# Altium schematic sheet Hoja_Control.SchDoc: Hoja_Control
size A4; SheetNumber: 4; SheetTotal: 6; Time: Hoja de Control
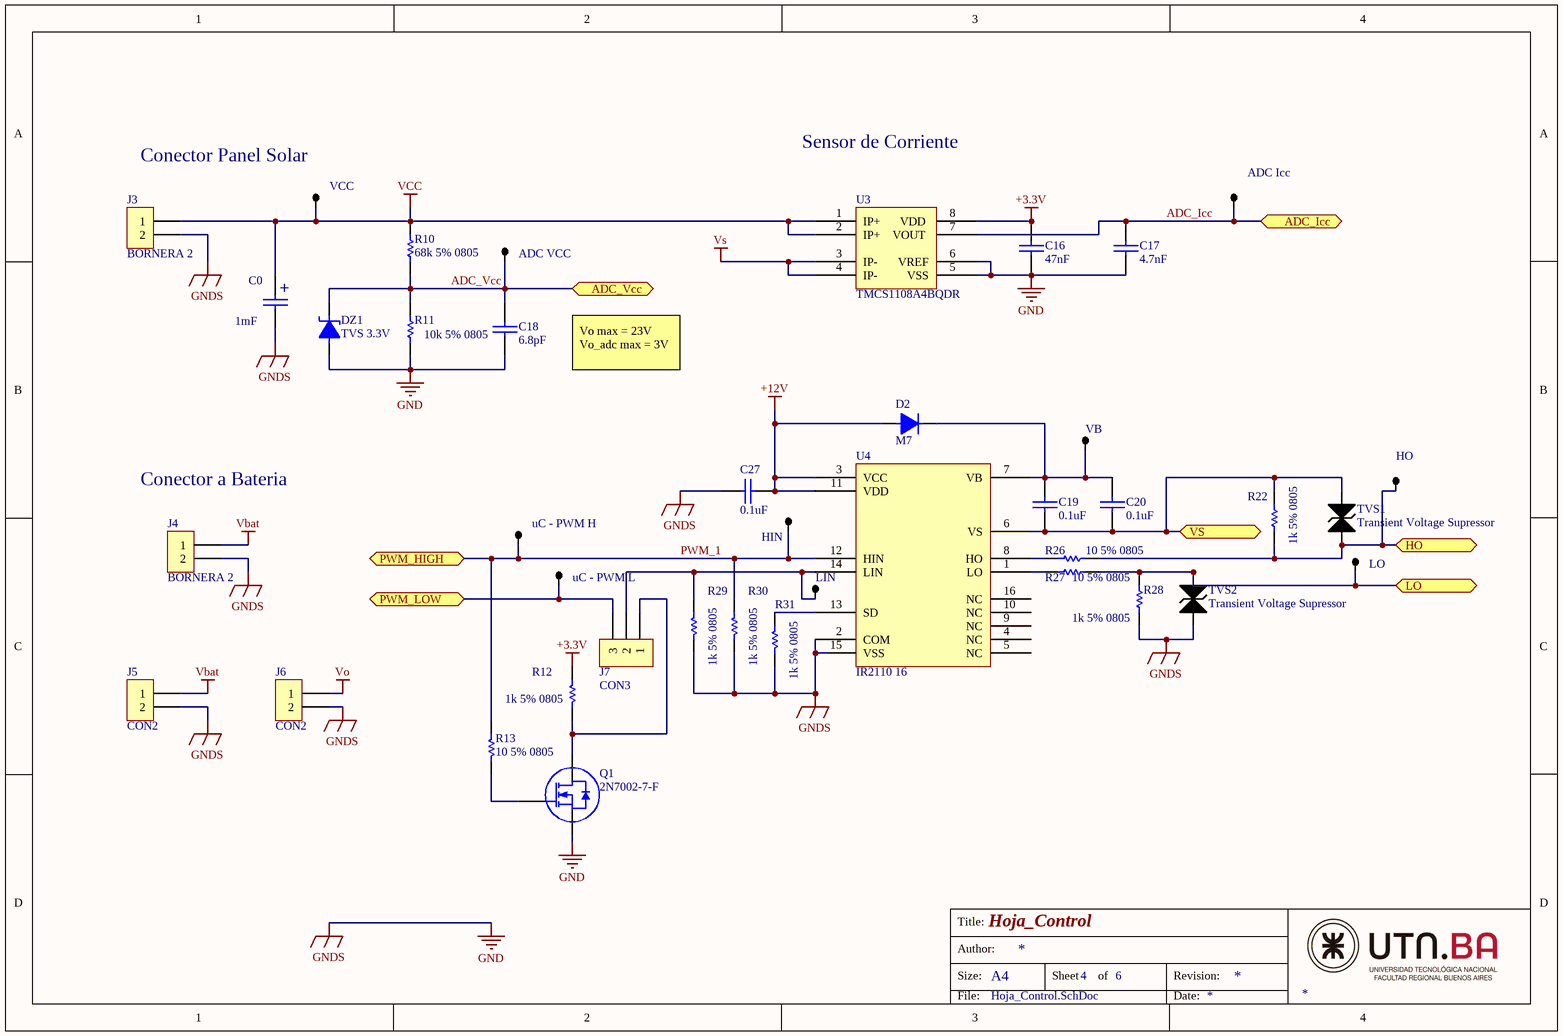
[diagram p0: Hoja_Control.SchDoc]

## Parts
ADC_Icc  ADC Icc  [TPTH]  (value not drawn)
ADC_VCC  ADC VCC  [TPTH]  (value not drawn)
C0  1mF  [CAPSMD8x8.3]
C16  47nF  [0805]
C17  4.7nF  [0805]
C18  6.8pF  [0805]
C19  0.1uF  [0805]
C20  0.1uF  [0805]
C27  0.1uF  [0805]
D2  M7  [DO-214AC]
DZ1  TVS 3.3V  [sod123]
HIN  HIN  [TPTH]
HO  HO  [TPTH]  (value not drawn)
J3  BORNERA 2  [Bornera2_DegsonH]
J4  BORNERA 2  [Bornera2_DegsonH]
J5  CON2  [SIP2]
J6  CON2  [SIP2]
J7  CON3  [SIP3]
LIN  LIN  [TPTH]  (value not drawn)
LO  LO  [TPTH]  (value not drawn)
Q1  2N7002-7-F  [SOT23]
R10  68k 5% 0805  [0805]
R11  10k 5% 0805  [0805]
R12  1k 5% 0805  [0805]
R13  10 5% 0805  [0805]
R22  1k 5% 0805  [0805]
R26  10 5% 0805  [0805]
R27  10 5% 0805  [0805]
R28  1k 5% 0805  [0805]
R29  1k 5% 0805  [0805]
R30  1k 5% 0805  [0805]
R31  1k 5% 0805  [0805]
TVS1  Transient Voltage Supressor  [SOD323]
TVS2  Transient Voltage Supressor  [SOD323]
U3  TMCS1108A4BQDR  [SOIC8]
U4  IR2110 16  [SOIC16W]
uC_-_PWM_H  PWM L  [TPTH]  (value not drawn)
uC_-_PWM_L  PWM H  [TPTH]  (value not drawn)
VB  VB  [TPTH]  (value not drawn)
VCC  VCC  [TPTH]  (value not drawn)

## Ports
ADC_Icc (bidir), ADC_Vcc (bidir), HO (bidir), LO (bidir), PWM_HIGH (bidir), PWM_LOW (bidir), VS (bidir)

## Nets
+3.3V: C16.1 R12.2 U3.8(VDD)
+12V: C27.1 D2.1 U4.3(VCC) U4.11(VDD)
GND: C0.2 C16.2 C17.2 C18.2 C27.2 DZ1.1 J3.2 J4.2 J5.2 J6.2 Q1.3(S) R11.1 R28.1 R29.1 R30.1 R31.1 TVS2.2 U3.5(VSS) U3.6(VREF) U4.2(COM) U4.15(VSS)  [also labelled GNDS]
Vbat: J4.1 J5.1
VCC: C0.1 J3.1 R10.2 U3.1(IP+) U3.2(IP+) VCC.1
Vo: J6.1
Vs: U3.3(IP-) U3.4(IP-)
ADC_Icc: ADC_Icc.1 C17.1 U3.7(VOUT) ; port ADC_Icc
ADC_Vcc: ADC_VCC.1 C18.1 DZ1.2 R10.1 R11.2 ; port ADC_Vcc
HO: HO.1 R22.1 R26.2 TVS1.2 ; port HO
LO: LO.1 R27.2 R28.2 TVS2.1 ; port LO
PWM_1: HIN.1 R13.2 R30.2 U4.12(HIN) uC_-_PWM_L.1 ; port PWM_HIGH
PWM_LOW: J7.3 uC_-_PWM_H.1 ; port PWM_LOW
VS: C19.1 C20.1 R22.2 TVS1.1 U4.6(VS) ; port VS  [a separate net that carries the same name]
NetC19_2: C19.2 C20.2 D2.2 U4.7(VB) VB.1
NetJ7_1: J7.1 Q1.2(D) R12.1
NetJ7_2: J7.2 LIN.1 R29.2 U4.14(LIN)
NetQ1_1: Q1.1(G) R13.1
NetR26_1: R26.1 U4.8(HO)
NetR27_1: R27.1 U4.1(LO)
NetR31_2: R31.2 U4.13(SD)

Not connected (* = marked no-connect by the designer): U4 4(NC) 5(NC) 9(NC) 10(NC) 16(NC)

## Notes on the sheet
- (near VCC) Conector Panel Solar
- Sensor de Corriente
- Vo max = 23V
  Vo_adc max = 3V
- Conector a Bateria
- Title:
- Size:
- Author:
- A4
- Sheet
- of
- Revision:
- File:
- Date:
- (in symbol CAPPOL) +

## Library data of the parts
ADC_Icc ADC_VCC HIN HO LIN LO uC_-_PWM_H uC_-_PWM_L VB VCC = TP
C0 = CAPPOL: Capacitores electrolíticos de aluminio 100 µF 35 V Radial, encapsulado - terminales SMD 1000 h a 105°C
C16-C18 = CAP
C19 C20 C27 = CAP: CAP CER 0.1UF X7R 0805
D2 = DIODO: Diodos Estándar 1000 V 1A Montaje en superficie SMA
DZ1 = DIODO ZENER
Q1 = MOSFET N: Canal N Montaje en superficie 60 V 115mA (Ta) 370mW (Ta) SOT-23-3
R10-R13 R22 R26-R31 = RES
TVS1 TVS2 = TVS
U3 = MLX91221KDC: Sensores de corriente 1 canal Efecto Hall Bidireccional 8-SOIC (ancho 0.154", 3.90mm)
U4 = IR2110 16: Medio puente controladores de compuerta IC No inversor 14-DIP